# Altium schematic sheet [03] - MCU.SchDoc: =ProjectName
size A4; CheckedBy: Ven; Author: Ven; CompanyName: HUST; Revision: V.1.0
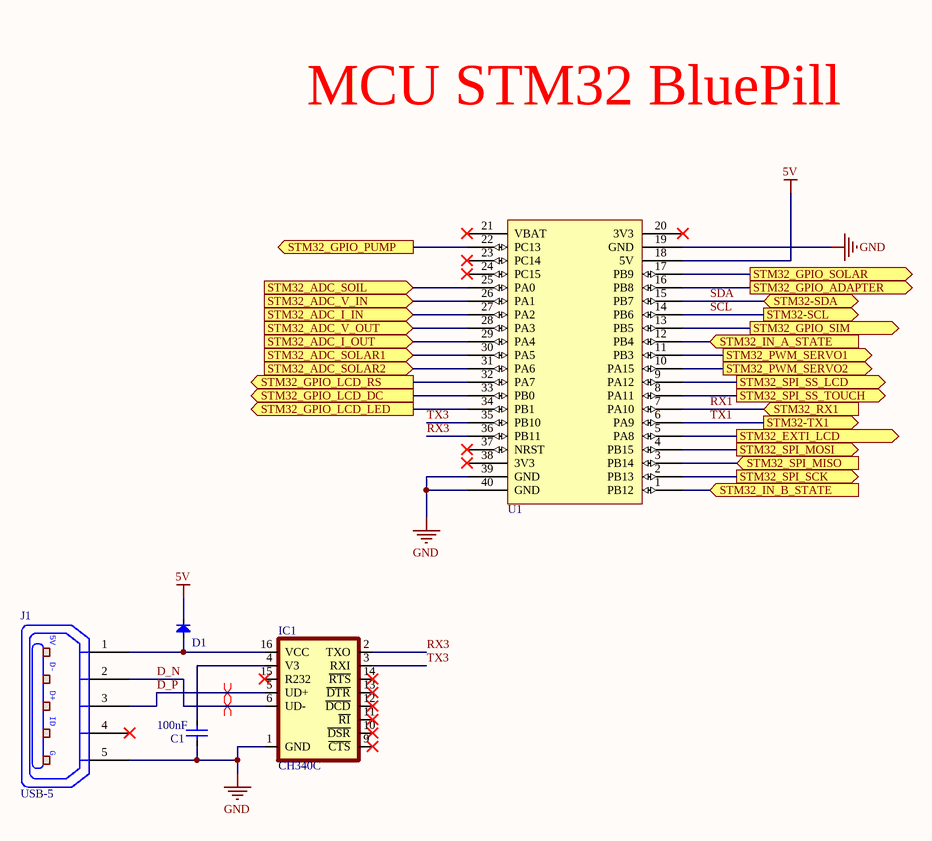
[diagram p0: [03] - MCU.SchDoc]

## Parts
C1  100nF  [CAP_0805]
D1  SS34  [DO-214AC(SMA)]  (value not drawn)
IC1  CH340C  [SO016]
J1  USB-5  [USB-M1]
U1  STM32 BluePill  [STM32 Bluepill]  (value not drawn)

## Ports
STM32-SCL (out), STM32-SDA (bidir), STM32-TX1 (out), STM32_ADC_I_IN (in), STM32_ADC_I_OUT (in), STM32_ADC_SOIL (in), STM32_ADC_SOLAR1 (in), STM32_ADC_SOLAR2 (in), STM32_ADC_V_IN (in), STM32_ADC_V_OUT (in), STM32_EXTI_LCD (out), STM32_GPIO_ADAPTER (out), STM32_GPIO_LCD_DC (out), STM32_GPIO_LCD_LED (out), STM32_GPIO_LCD_RS (out), STM32_GPIO_PUMP (out), STM32_GPIO_SIM (out), STM32_GPIO_SOLAR (out), STM32_IN_A_STATE (in), STM32_IN_B_STATE (in), STM32_PWM_SERVO1 (out), STM32_PWM_SERVO2 (out), STM32_RX1 (in), STM32_SPI_MISO (in), STM32_SPI_MOSI (out), STM32_SPI_SCK (out), STM32_SPI_SS_LCD (out), STM32_SPI_SS_TOUCH (out)

## Nets
5V: D1.2(K) U1.18(5V)
GND: C1.1 IC1.1(GND) J1.5(P5) U1.19(GND) U1.39(GND) U1.40(GND)
D_N: IC1.6(UD-) J1.2(P2)
D_P: IC1.5(UD+) J1.3(P3)
RX1: U1.7(PA10) ; port STM32_RX1
RX3: IC1.2(TXO) U1.36(PB11)
SCL: U1.14(PB6) ; port STM32-SCL
SDA: U1.15(PB7) ; port STM32-SDA
STM32_ADC_I_IN: U1.27(PA2) ; port STM32_ADC_I_IN
STM32_ADC_I_OUT: U1.29(PA4) ; port STM32_ADC_I_OUT
STM32_ADC_SOIL: U1.25(PA0) ; port STM32_ADC_SOIL
STM32_ADC_SOLAR1: U1.30(PA5) ; port STM32_ADC_SOLAR1
STM32_ADC_SOLAR2: U1.31(PA6) ; port STM32_ADC_SOLAR2
STM32_ADC_V_IN: U1.26(PA1) ; port STM32_ADC_V_IN
STM32_ADC_V_OUT: U1.28(PA3) ; port STM32_ADC_V_OUT
STM32_EXTI_LCD: U1.5(PA8) ; port STM32_EXTI_LCD
STM32_GPIO_ADAPTER: U1.16(PB8) ; port STM32_GPIO_ADAPTER
STM32_GPIO_LCD_DC: U1.33(PB0) ; port STM32_GPIO_LCD_DC
STM32_GPIO_LCD_LED: U1.34(PB1) ; port STM32_GPIO_LCD_LED
STM32_GPIO_LCD_RS: U1.32(PA7) ; port STM32_GPIO_LCD_RS
STM32_GPIO_PUMP: U1.22(PC13) ; port STM32_GPIO_PUMP
STM32_GPIO_SIM: U1.13(PB5) ; port STM32_GPIO_SIM
STM32_GPIO_SOLAR: U1.17(PB9) ; port STM32_GPIO_SOLAR
STM32_IN_A_STATE: U1.12(PB4) ; port STM32_IN_A_STATE
STM32_IN_B_STATE: U1.1(PB12) ; port STM32_IN_B_STATE
STM32_PWM_SERVO1: U1.11(PB3) ; port STM32_PWM_SERVO1
STM32_PWM_SERVO2: U1.10(PA15) ; port STM32_PWM_SERVO2
STM32_SPI_MISO: U1.3(PB14) ; port STM32_SPI_MISO
STM32_SPI_MOSI: U1.4(PB15) ; port STM32_SPI_MOSI
STM32_SPI_SCK: U1.2(PB13) ; port STM32_SPI_SCK
STM32_SPI_SS_LCD: U1.9(PA12) ; port STM32_SPI_SS_LCD
STM32_SPI_SS_TOUCH: U1.8(PA11) ; port STM32_SPI_SS_TOUCH
TX1: U1.6(PA9) ; port STM32-TX1
TX3: IC1.3(RXI) U1.35(PB10)
NetC1_2: C1.2 IC1.4(V3)
NetD1_1: D1.1(A) IC1.16(VCC) J1.1(P1)

Not connected (* = marked no-connect by the designer): IC1 9(~{CTS})* 10(~{DSR})* 11(~{RI})* 12(~{DCD})* 13(~{DTR})* 14(~{RTS})* 15(R232)*; J1 4(P4)*; U1 20(3V3)* 21(VBAT)* 23(PC14)* 24(PC15)* 37(NRST)* 38(3V3)*

## Layout directives
differential pair: D_N, D_P

## Notes on the sheet
- MCU STM32 BluePill
- Project:
- Page Contents:
- Size:
- Date:
- A4
- Checked by:
- Time:
- Revision:
- Sheet
- of
- File:
- (in symbol USB-5) 5V; D-; D+; ID; G

## Library data of the parts
C1 = CapSMD: Capacitor; Value: 33p; Published: 8-Jun-2000; LatestRevisionDate: 17-Jul-2002; LatestRevisionNote: Re-released for DXP Platform.; PackageReference: RAD-0.3; Publisher: Altium Limited
D1 = Diode SMD: Diode Schottky 1N5822 3A 40V SMA; Code - JEDEC: DO-214-AB; Value: 1N5007; Published: 8-Jun-2000; Revision: July-2002: Re-released for DXP Platform.; Publisher: Altium Limited
IC1 = CH340C: USB to serial chip CH340; MF: WCH; Package: Package; Check_prices: https://www.snapeda.com/parts/CH340C/WCH/view-part/5428851/?ref=eda; Value: *; Price: None; MP: CH340C; Availability: Unavailable; SnapEDA_Link: https://www.snapeda.com/parts/CH340C/WCH/view-part/5428851/?ref=snap
J1 = USB-5: Manufacturer: FCI; Manufacturer Part Number: 10118193-0001LF; Connector Type: USB - micro B; Number of Contacts: 5; Gender: Receptacle; Specifications: USB 2.0; .Creator: MM; .Checked PCB: RF; Supplier 1: Digi-Key; RoHS: RoHS Compliant; Category: Connectors, Interconnects; Stock 1: 28642; Pricing 1: 1=0.46, 10=0.433, 25=0.3712, 50=0.3156, 100=0.3032, 250=0.27224, 500=0.25988 (USD); Packaging: Cut Tape (CT); Mounting Type: Surface Mount, Right Angle, Horizontal; Features: Shielded, Solder Retention; Ingress Protection: -; ComponentLink1URL: http://portal.fciconnect.com/Comergent//fci/drawing/10118193.pdf; ComponentLink1Description: http://portal.fciconnect.com/Comergent//fci/drawing/10118193.pdf; Supplier Part Number 1: 609-4616-1-ND; .Checked SCH: MM